# Altium project FanHumidityController.PrjPcb
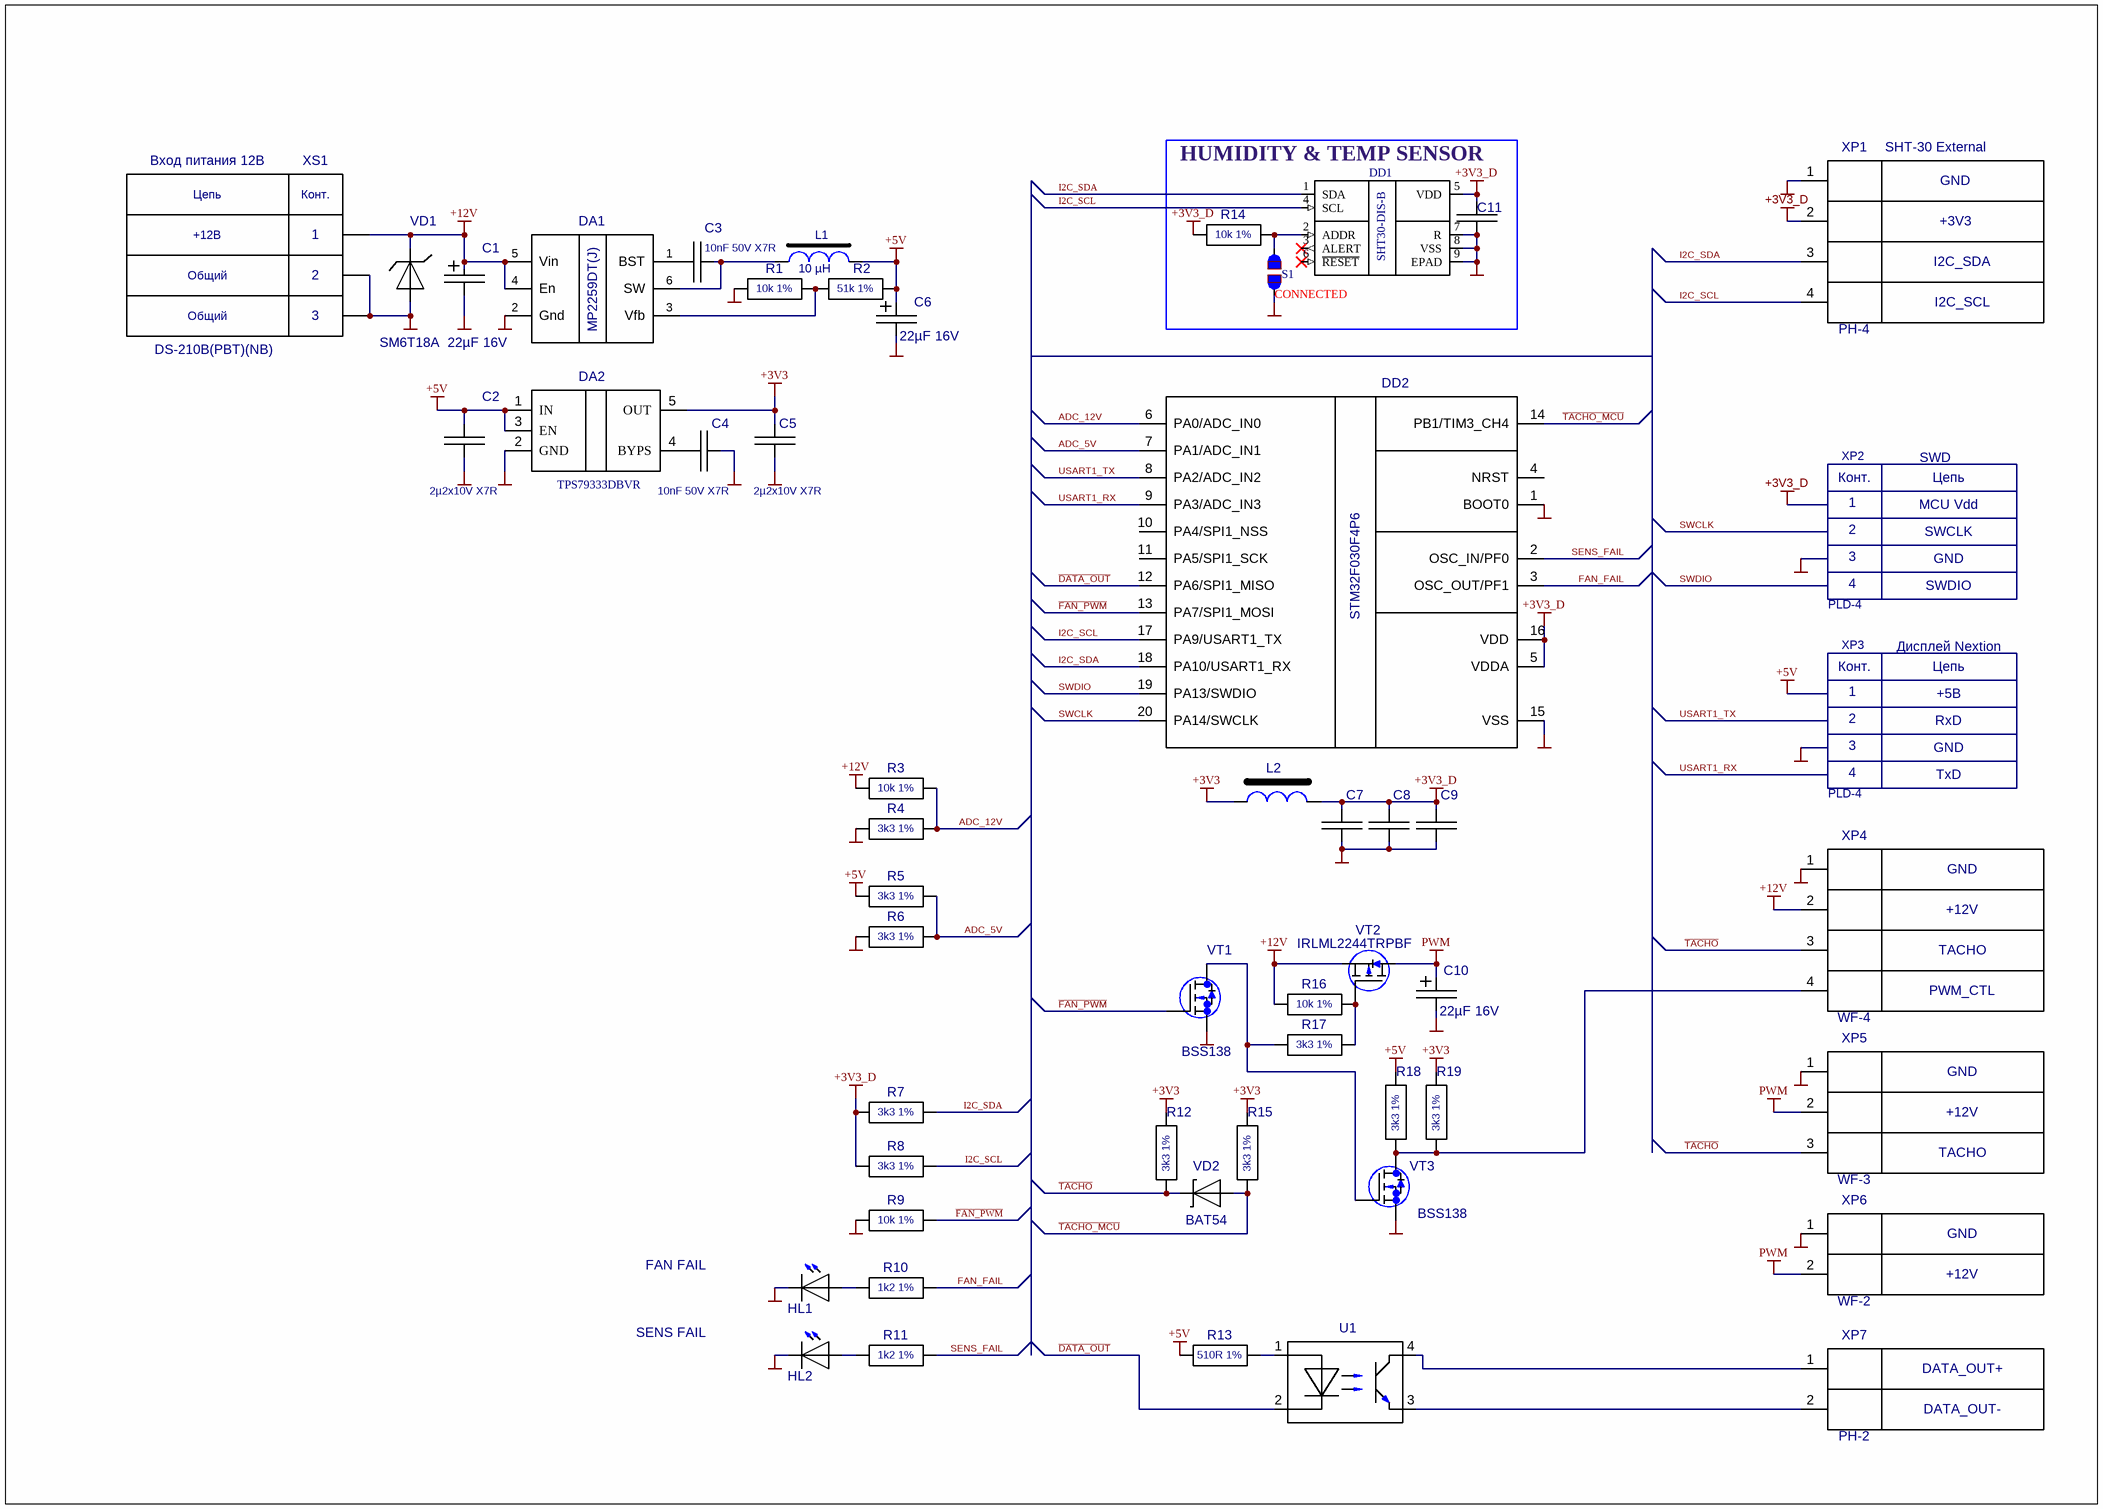
[diagram p0: FanHumidityController.SchDoc]
1 sheet, 54 parts. Net scope: global (net labels, ports and power ports of the same name join across sheets).
Board file: FanHumidityController.PcbDoc

## Sheet FanHumidityController.SchDoc
size A3; SheetNumber: 1; SheetTotal: 1

### Parts
?  Шапка разъёма  (value not drawn)  (graphical)
C1  22µF 16V  [CapAlumD5.0xH7.0]
C2  2µ2x10V X7R  [0603_CAP]
C3  10nF 50V X7R  [0603_CAP]
C4  10nF 50V X7R  [0603_CAP]
C5  2µ2x10V X7R  [0603_CAP]
C6  22µF 16V  [CapAlumD5.0xH7.0]
C7  2µ2x10V X7R  [0603_CAP]  (value not drawn)
C8  µ10x10V X7R  [0402_CAP]  (value not drawn)
C9  µ10x10V X7R  [0402_CAP]  (value not drawn)
C10  22µF 16V  [CapAlumD5.0xH7.0]
C11  µ10x10V X7R  [0402_CAP]  (value not drawn)
DA1  MP2259DT(J)  [SOT23-6]
DA2  TPS79333DBVR  [SOT23-5]
DD1  SHT30-DIS-B  [DFN-8]
DD2  STM32F030F4P6  [TSSOP20]
HL1  KP-2012SYC  [KP-2012_YEL]  (value not drawn)
HL2  KP-2012SYC  [KP-2012_YEL]  (value not drawn)
L1  value 10 µH  [1210L]  (hidden comment: NLCV32T)
L2  470R BLM18PG471SN1D  [0603_BLM18]  (value not drawn)
R1  10k 1%  [0603_RES]
R2  51k 1%  [0603_RES]
R3  10k 1%  [0603_RES]
R4  3k3 1%  [0603_RES]
R5  3k3 1%  [0603_RES]
R6  3k3 1%  [0603_RES]
R7  3k3 1%  [0603_RES]
R8  3k3 1%  [0603_RES]
R9  10k 1%  [0603_RES]
R10  1k2 1%  [0603_RES]
R11  1k2 1%  [0603_RES]
R12  3k3 1%  [0603_RES]
R13  510R 1%  [0603_RES]
R14  10k 1%  [0603_RES]
R15  3k3 1%  [0603_RES]
R16  10k 1%  [0603_RES]
R17  3k3 1%  [0603_RES]
R18  3k3 1%  [0603_RES]
R19  3k3 1%  [0603_RES]
S1  SOLDER BRIDGE  [SOLDER BRIDGE 4.6x2]  (value not drawn)  (no BOM)
U1  PC817  [DIP4]  (value not drawn)
VD1  SM6T18A  [SMB-STPS3L60U]
VD2  BAT54  [SOT-23-(2)]
VT1  BSS138  [SOT-23 MOSFET]
VT2  IRLML2244TRPBF  [SOT-23 MOSFET]
VT3  BSS138  [SOT-23 MOSFET]
XP1  PH-4  [PH-4]  (parts A,B,C,D of 4)
XP2  PLD-4  [JP-4]
XP3  PLD-4  [JP-4]
XP4  WF-4  [WF-4]  (parts A,B,C,D of 4)
XP5  WF-3  [WF-3]  (parts A,B,C of 3)
XP6  WF-2  [WF-2]  (parts A,B of 2)
XP7  PH-2  [PH-2]  (parts A,B of 2)
XS1  DS-210B(PBT)(NB)  [DS-210B(PBT)(NB)]  (parts A,B,C of 3)

### Blocks framed on the sheet
HUMIDITY & TEMP SENSOR: C11 DD1 R14 S1

### Nets
+3V3: C5.2 DA2.5(OUT) L2.1 R12.1 R15.1 R19.1
+3V3_D: C7.2 C8.1 C9.1 C11.1 DD1.5(VDD) DD2.5(VDDA) DD2.16(VDD) L2.2 R7.2 R8.2 R14.1 XP1.2 XP2.1
+5V: C2.2 C6.PLUS DA2.1(IN) DA2.3(EN) L1.2 R2.1 R5.2 R13.2 R18.1 XP3.1
+12V: C1.PLUS DA1.4(En) DA1.5(Vin) R3.2 R16.2 VD1.2(K) VT2.2 XP4.2 XS1.1(Штыревой_контакт)
GND: C1.MINUS C2.1 C4.2 C5.1 C6.MINUS C7.1 C8.2 C9.2 C10.MINUS C11.2 DA1.2(Gnd) DA2.2(GND) DD1.7(R) DD1.8(VSS) DD1.9(EPAD) DD2.1(BOOT0) DD2.15(VSS) HL1.2(K) HL2.2(K) R1.2 R4.2 R6.2 R9.2 S1.1(IO) VD1.1(A) VT1.2 VT3.2 XP1.1 XP2.3 XP3.3 XP4.1 XP5.1 XP6.1 XS1.2(Размыкающийся_контакт) XS1.3(Цилиндрич._контакт)
PWM: C10.PLUS VT2.3 XP5.2 XP6.2
ADC_5V: DD2.7(PA1/ADC_IN1) R5.1 R6.1
ADC_12V: DD2.6(PA0/ADC_IN0) R3.1 R4.1
~{DATA_OUT}: DD2.12(PA6/SPI1_MISO) U1.2(K)
~{FAN_PWM}: DD2.13(PA7/SPI1_MOSI) R9.1 VT1.1
FAN_FAIL: DD2.3(OSC_OUT/PF1) R10.1
I2C_SCL: DD1.4(SCL) DD2.17(PA9/USART1_TX) R8.1 XP1.4
I2C_SDA: DD1.1(SDA) DD2.18(PA10/USART1_RX) R7.1 XP1.3
SENS_FAIL: DD2.2(OSC_IN/PF0) R11.1
SWCLK: DD2.20(PA14/SWCLK) XP2.2
SWDIO: DD2.19(PA13/SWDIO) XP2.4
~{TACHO}: R12.2 VD2.3 XP4.3 XP5.3
~{TACHO_MCU}: DD2.14(PB1/TIM3_CH4) R15.2 VD2.1
USART1_RX: DD2.9(PA3/ADC_IN3) XP3.4
USART1_TX: DD2.8(PA2/ADC_IN2) XP3.2
NetC3_1: C3.1 DA1.1(BST)
NetC3_2: C3.2 DA1.6(SW) L1.1
NetC4_1: C4.1 DA2.4(BYPS)
NetDA1_3: DA1.3(Vfb) R1.1 R2.2
NetDD1_2: DD1.2(ADDR) R14.2 S1.2(IO)
NetHL1_1: HL1.1(A) R10.2
NetHL2_1: HL2.1(A) R11.2
NetR13_1: R13.1 U1.1(A)
NetR16_1: R16.1 R17.1 VT2.1
NetR17_2: R17.2 VT1.3 VT3.1
NetR18_2: R18.2 R19.2 VT3.3 XP4.4
NetU1_3: U1.3(E) XP7.2
NetU1_4: U1.4(K) XP7.1

Not connected (* = marked no-connect by the designer): DD1 3(ALERT)* 6(~{RESET})*; DD2 4(NRST) 10(PA4/SPI1_NSS) 11(PA5/SPI1_SCK); VD2 NC

### Notes on the sheet
- (near ?) Вход питания 12В
- XS1
- (near XP1) XP1
- SHT-30 External
- GND
- (near ?) +12В
- +3V3
- Общий
- (near S1) CONNECTED
- I2C_SCL
- I2C_SDA
- SWD
- MCU Vdd
- SWDIO
- SWCLK
- Дисплей Nextion
- RxD
- +5B
- TxD
- (near XP4) XP4
- +12V
- TACHO
- PWM_CTL
- XP5
- XP6
- FAN FAIL
- SENS FAIL
- (near XP7) XP7
- DATA_OUT+
- DATA_OUT-
- Подп. дата
- Инв. № дубл.
- Взам. инв. №
- Подп. и дата
- Инв. № подл.
- Изм.
- Лист
- № докум.
- Подп.
- Дата
- ALTIUM GOSTBOM2.0 KEV
- Файл:
- Копировал
- Формат А3
- (in symbol PLD-4_inch) Конт.; Цепь
- (in symbol Шапка разъёма_mils) Цепь; Конт.

### Library data of the parts
? = Шапка разъёма_mils: Value: Шапка разъёма; Part Number: *
C1 C6 C10 = K50-35 mini: D=5.0, H=7.0; Value: 22µF 16V
C2 C5 C7 = C0603: Value: 2µ2x10V X7R
C3 C4 = C0603: Part Number: GRM1885C1H222JA01J; Value: 10nF 50V X7R
C8 C9 C11 = C0402: PN: CC0402KRX7R8BB104; Value: µ10x10V X7R
DA1 = MP2359DT(J): Value: MP2259DT(J)
DD1 = SHT30-DIS-B: ±2% (10-90%RH) Digital humidity and temperature sensor; Manufacturer: Sensirion; ProcessType: SMT; Type: Chips; PN Alternative 2: *; PN Alternative 1: *; Package: DFN-8; PN: SHT30-DIS-B; URL: https://sensirion.com/products/catalog/SHT30-DIS-B/
HL1 HL2 = KP-2012_YEL: Value: KP-2012SYC; Part Number: KP-2012SYC
L1 = NLCV32T: NLCV32T-100K-EF, 10 мкГн, 1210, 10%, Индуктивность SMD; PN: NLCV32T-100K-EF
L2 = BLM18PG: Value: 470R BLM18PG471SN1D
R1 R3 R9 R14 R16 = R0603: RC0603FR-0710KL; Value: 10k 1%; Part Number: RC0603FR-0710KL
R2 = R0603: RC0603FR-0751KL; Value: 51k 1%; Part Number: RC0603FR-0751KL
R4-R8 R12 R15 R17-R19 = R0603: Part Number: RC0603FR-073K3L; Value: 3k3 1%
R10 R11 = R0603: Part Number: RC0603FR-071K2L; Value: 1k2 1%
R13 = R0603: Value: 510R 1%
VD1 = SM6T27A: Защитный диод, однонаправленный, 18В, 600Вт [SMB]; Value: SM6T18A
VT1 VT3 = MMBF170: Value: *
XP2 XP3 = PLD-4_inch: 2 x 2 pin, 2.54 mm; Value: KLS1-207-2-04-S; Cell: *; ManufacturerPartNmber: KLS1-207-2-04-S; Tolerance: *; Current: *; Voltage: *; Power: *
XS1 = DS-210B(PBT)(NB): Гнездо питания 2,1х5,5мм на панель; Value: DS-210B(PBT)(NB); Part Number: DS-210B(PBT)(NB)
DA2 = TPS79333DBVR: Value: TPS79333DBVR
DD2 = STM32F030F4P6: Value: *
S1 = SOLDER BRIDGE: Type: Jumper
U1 = PC817: Value: *
VD2 = BAT54: Value: BAT54
VT2 = IRLML2244TRPBF: Value: *
XP1 = PH-4: Value: *
XP4 = WF-4: Value: *
XP5 = WF-3: Value: *
XP6 = WF-2: Value: *
XP7 = PH-2: Value: PH-2